# EAGLE design Faulhaber Temp sensor (EAGLE 9.6.2)
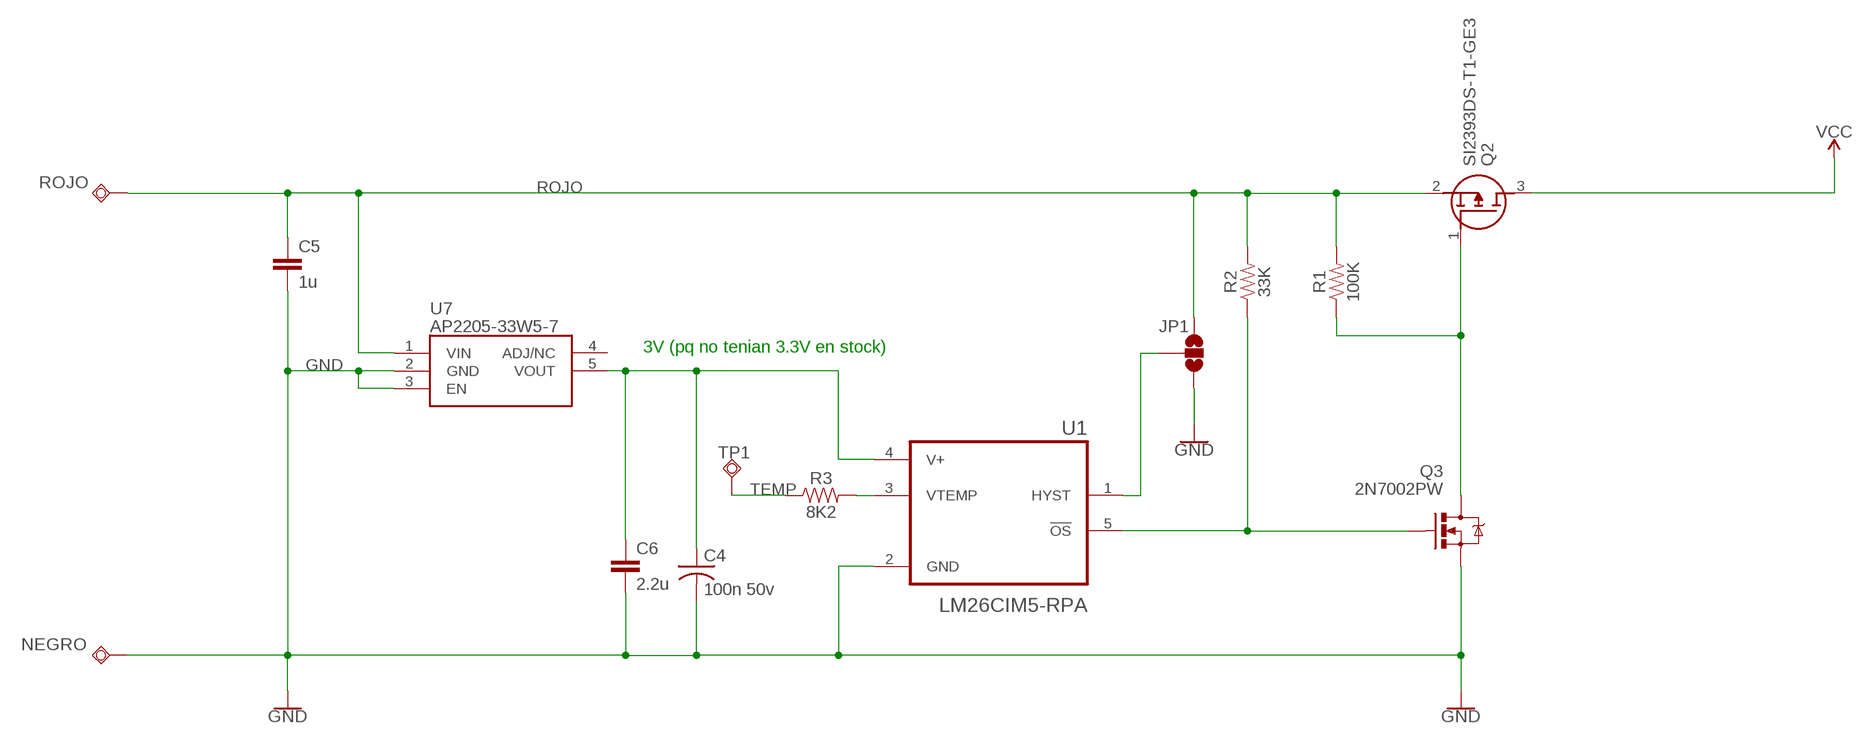
[diagram p0: schematic, sheet 1]

## Parts
C4  100n 50v  C-USC0805  [C0805]
C5  1u  4.7UF-6.3V-10%(0603)0603  [0603-CAP]
C6  2.2u  4.7UF-6.3V-10%(0603)0603  [0603-CAP]
JP1  JUMPER-SMT_3_NO_SILK  [SMT-JUMPER_3_NO_SILK]
NEGRO  TESTPAD_TPSQTP10SQ  [TESTPAD_TP10SQ]
Q2  SI2393DS-T1-GE3  [SOT95P237X112-3N]
Q3  2N7002PW  MOSFET-NCHANNEL2N7002PW  [SOT323]
R1  100K  RESISTOR0603  [0603]
R2  33K  RESISTOR0603  [0603]
R3  8K2  RESISTOR0603  [0603]
ROJO  TESTPAD_TPSQTP10SQ  [TESTPAD_TP10SQ]
TP1  TESTPAD_TPSQTP20R  [TESTPAD_TP20R]
U1  LM26CIM5-RPA  [SOT95P280X145-5N]
U7  AP2205-33W5-7  AP2205-W5-7  [SOT95P282X145-5N]

## Nets
GND: C4.2 C5.2 C6.2 JP1.3 NEGRO.TP Q3.2(S) U1.2(GND) U7.2(GND) U7.3(EN)
N$1: JP1.2 U1.1(HYST)
N$2: Q3.1(G) R2.1 U1.5(!OS)
N$3: Q2.1(G) Q3.3(D) R1.1
N$5: R3.2 U1.3(VTEMP)
ROJO: C5.1 JP1.1 Q2.2(S) R1.2 R2.2 ROJO.TP U7.1(VIN)
TEMP: R3.1 TP1.TP
VCC: Q2.3(D)
VCC1: C4.1 C6.1 U1.4(V+) U7.5(VOUT)
Unconnected: U7.4(ADJ/NC)

## Notes on the sheet
- 3V (pq no tenian 3.3V en stock)

## Library data of the parts
C4 = adafruit:C-US: CAPACITOR, American symbol
C5 C6 = SparkFun-Capacitors:4.7UF-6.3V-10%(0603): CAP-08280; PROD_ID: CAP-08280; VALUE: 4.7uF
JP1 = SparkFun-Jumpers:JUMPER-SMT_3_NO: Normally open jumper This jumper has three pads in close proximity to each other. Apply solder to close the connection(s).
NEGRO ROJO TP1 = BeagleBone_Blue_R3:TESTPAD_TPSQ: Test pad
Q2 = SamacSys_Parts:SI2393DS-T1-GE3: P-Channel 30-V (D-S) MOSFET SOT-23 , 22.7 m @ 10V m @ 7.5V 33 m @ 4.5V Source: Datasheet <https://www.arrow.com/en/products/si2393ds-t1-ge3/vishay>; ARROW_PART_NUMBER: SI2393DS-T1-GE3; ARROW_PRICE-STOCK: https://www.arrow.com/en/products/si2393ds-t1-ge3/vishay?utm_currency=USD&region=nac; DESCRIPTION: P-Channel 30-V (D-S) MOSFET SOT-23 , 22.7 m @ 10V m @ 7.5V 33 m @ 4.5V; HEIGHT: 1.12mm; MANUFACTURER_NAME: Vishay; MANUFACTURER_PART_NUMBER: SI2393DS-T1-GE3; MOUSER_PART_NUMBER: 78-SI2393DS-T1-GE3; MOUSER_PRICE-STOCK: https://www.mouser.co.uk/ProductDetail/Vishay-Semiconductors/SI2393DS-T1-GE3?qs=BJlw7L4Cy7%2FUF13oxTStOQ%3D%3D
Q3 = SparkFun-DiscreteSemi:MOSFET-NCHANNEL: Common NMOSFET Parts MFG P/N Store ID Prod ID FDD8780 TRANS-09984 SI7820DN TRANS-11055 FDS6630A IC-08089 2N7002PW TRANS-11151 FQP30N06L COM-10213 TRANS-10060 BSS123LT1G TRANS-08345 BSS138 TRANS-00830 BS170 2N7000; PROD_ID: TRANS-11151
R1-R3 = SparkFun-Resistors:RESISTOR: Generic Resistor Package
U1 = LM26CIM5-RPA:LM26CIM5-RPA
U7 = AP2205-W5-7:AP2205-W5-7: LDO Voltage Regulators LDO CMOS LowCurr Source: Datasheet <https://www.diodes.com/assets/Datasheets/AP2206.pdf>; DESCRIPTION: LDO Voltage Regulators LDO CMOS LowCurr; HEIGHT: 1.45mm; MANUFACTURER_NAME: Diodes Inc.; MANUFACTURER_PART_NUMBER: AP2205-W5-7; MOUSER_PART_NUMBER: 621-AP2205-W5-7; MOUSER_PRICE-STOCK: https://www.mouser.com/Search/Refine.aspx?Keyword=621-AP2205-W5-7

## Board
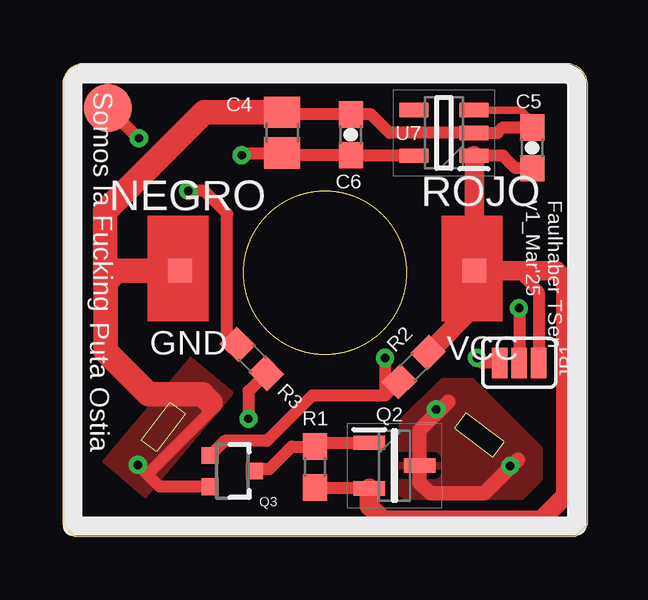
[diagram p1: board, top side]
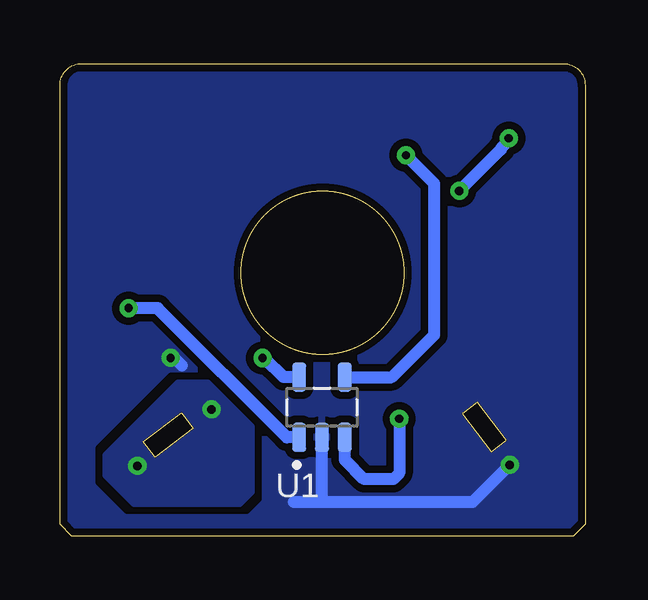
[diagram p2: board, bottom side, seen from below]

Size 21.9 x 19.7 mm. Coordinates in mm from the lower left corner, seen from the top.
Outline: 16.83,5.15 16.35,4.51 17.94,3.3 18.42,3.94 16.83,5.15
Outline: 5.13,5.11 3.92,3.52 3.28,4 4.49,5.6 5.13,5.11
Outline: 21.9,18.8 arc90 21,19.7 0.9,19.7 arc90 0,18.8 0,0.5 0.5,0 21.4,0 21.9,0.5 21.9,18.8
Outline: circle at 10.94,10.99 radius 3.4
Copper layers (1*16): Top 0.035mm / dielectric 1.5mm / Bottom 0.035mm
Design rules "default *": minimum track width 6mil, minimum drill 0.35mm, track to track 6mil, track to pad 6mil, pad to pad 6mil, via to via 6mil, smd to smd 0mil, copper to edge 1mil, drill to drill 6mil, minimum pad ring 10mil, minimum via ring 8mil, stop-mask expansion 4mil, vias tented up to drill 0mil, thermal gap 10mil

### Footprints (pad centres in the part's own frame; a part is rotated, then mirrored left to right if it is on the bottom)
C0805 = smd 1.3 x 1.5: 1 -0.85,0; 2 0.85,0
0603-CAP = smd 1.1 x 1: 1 -0.85,0; 2 0.85,0
SMT-JUMPER_3_NO_SILK = smd 0.635 x 1.27: 1 -0.813,0; 2 0,0; 3 0.813,0
TESTPAD_TP10SQ = smd 1 x 1: TP 0,0
SOT95P237X112-3N = smd 1.3 x 0.6: 1 -1.05,0.95; 2 -1.05,-0.95; 3 1.05,0
SOT323 = smd 0.7 x 0.7: 1 -0.65,-0.925; 2 0.65,-0.925; 3 0,0.925
0603 = smd 1.1 x 1: 1 -0.85,0; 2 0.85,0
TESTPAD_TP20R = smd 2 x 2: TP 0,0
SOT95P280X145-5N = smd 1.21 x 0.59: 1 -1.255,0.95; 2 -1.255,0; 3 -1.255,-0.95; 4 1.255,-0.95; 5 1.255,0.95
SOT95P282X145-5N = smd 1.2 x 0.6: 1 -1.25,0.95; 2 -1.25,0; 3 -1.25,-0.95; 4 1.25,-0.95; 5 1.25,0.95

### Placement (x,y rotation side)
C4  9.16,16.82 90 top
C5  19.58,16.19 90 top
C6  12.02,16.73 90 top
JP1  19.04,7.23 180 top
NEGRO  4.9,11.07 0 top
Q2  13.84,2.95 0 top
Q3  7.08,2.72 270 top
R1  10.52,2.89 270 top
R2  14.65,7.06 45 top
R3  7.9,7.4 315 top
ROJO  17.18,11.07 0 top
TP1  1.89,17.85 0 top
U1  10.97,5.38 90 bottom
U7  15.9,16.81 180 top

### Tracks (layer width: path | path; a pad name or v marks a point on that pad's centre or on a via)
GND  (via drill 0.35)
  Top 0.305: U7.3 19.11,17.76 19.58,17.29 C5.2
  Top 0.508: C4.2 9.25,17.58 C6.2 12.87,17.58 13.64,16.81 U7.2 18.14,16.81 18.37,17.04 C5.2 | 6.18,5.57 6.18,5.22 3.54,2.58 v3.14,2.98 4.05,2.07 Q3.2 | JP1.3 17.49,7.23 v17.28,7.44
  Top 1.016: NEGRO.TP 2.26,11.07 1.79,10.6 | 1.79,10.6 1.77,10.58 1.77,13.55 5.9,17.67 C4.2 | 1.79,10.6 1.79,7.71 3.58,5.92 5.83,5.92 6.18,5.57
  Bottom 0.508: v17.28,7.44 17.14,7.44 16.81,7.11 | 12.14,1.44 10.97,1.44 U1.2 | 10.9,1.44 4.68,1.44 v3.14,2.98 v3.13,2.99
  pour Top: 5.33,7.45 1.71,3.13 3.48,1.64 7.1,5.96
  pour Bottom: 5.34,7.46 1.7,3.12 3.43,1.66 7.08,6
  pour Bottom (isolate 0.305, rank 2): -0.19,19.95 21.77,19.95 22.64,19.08 22.64,0.79 21.27,-0.58 0.24,-0.58 -0.61,0.27 -0.61,19.53
N$1  (via drill 0.35)
  Top 0.508: v19.03,9.51 v19.04,9.5 JP1.2
  Bottom 0.508: U1.1 12.44,4.13 17.82,9.51 v19.03,9.51
N$2  (via drill 0.35)
  Top 0.508: 13.45,5.86 R2.1 | 13.45,5.86 10.41,5.86 8.53,3.98 6.76,3.98 Q3.1 | v13.45,7.43 13.45,5.86
  Bottom 0.508: U1.5 12.56,6.64 13.36,7.43 v13.45,7.43
N$3
  Top 0.508: Q2.1 10.68,3.9 R1.1 9.55,3.74 8.63,2.82 8.1,2.82 Q3.3
N$5  (via drill 0.35)
  Top 0.508: R3.2 7.75,6.05 v7.75,4.9
  Bottom 0.508: v7.75,4.9 7.75,2.64 8,2.39 9.21,2.39 10.02,3.2 U1.3
ROJO
  Top 0.508: C5.1 18.89,15.34 18.37,15.86 U7.1 17.19,15.82 | ROJO.TP 17.19,11.08 | 18.9,11.07 18.98,11.07 19.86,10.19 JP1.1 | Q2.2 10.56,2 R1.2
  Top 0.813: Q2.2 12.79,1.26 13.38,0.67 19.95,0.67 20.99,1.71 20.99,10.66 20.59,11.07 18.9,11.07 ROJO.TP | ROJO.TP 17.17,11.08 17.17,15.84 U7.1 | ROJO.TP 17.18,9.59 R2.2
TEMP  (via drill 0.35)
  Top 0.508: R3.1 6.86,8.44 6.86,13.44 5.91,14.4 v5.25,14.4 | 1.69,17.65 TP1.TP 1.92,17.85 v3.18,16.59
  Bottom 0.508: v5.25,14.4 3.51,16.13 3.51,16.17 3.18,16.5 v3.18,16.59
VCC  (via drill 0.35)
  Top 0.61: 16.08,5.61 14.89,4.42 Q2.3 14.89,2.24 15.34,1.79 17.59,1.79 18.99,3.19
  other vias: 18.67,2.94 15.58,5.29
  pour Top: 14.18,4.78 15.85,6.45 17.07,6.45 19.86,3.66 19.86,2.4 19.13,1.67 14.29,1.67 14.18,1.78
  pour Bottom: 13.92,4.56 15.74,6.38 16.96,6.38 19.96,3.38 19.96,2.54 18.8,1.38 14.4,1.38 13.92,1.86
VCC1  (via drill 0.35)
  Top 0.508: U7.5 14.63,15.88 C6.1 9.25,15.88 C4.1 7.56,15.97 v7.47,15.88
  Bottom 0.508: U1.4 8.06,6.64 6.29,8.4 6.29,14.7 v7.47,15.88
(copper drawn outside any net)
  shapes: Top area x2

### Text on the board
tPlace: Somos la Fucking | Faulhaber TSen / v1_Mar'25 | GND | VCC | Puta Ostia